# EAGLE design qtpychargerpzt3904 (EAGLE 9.6.2)
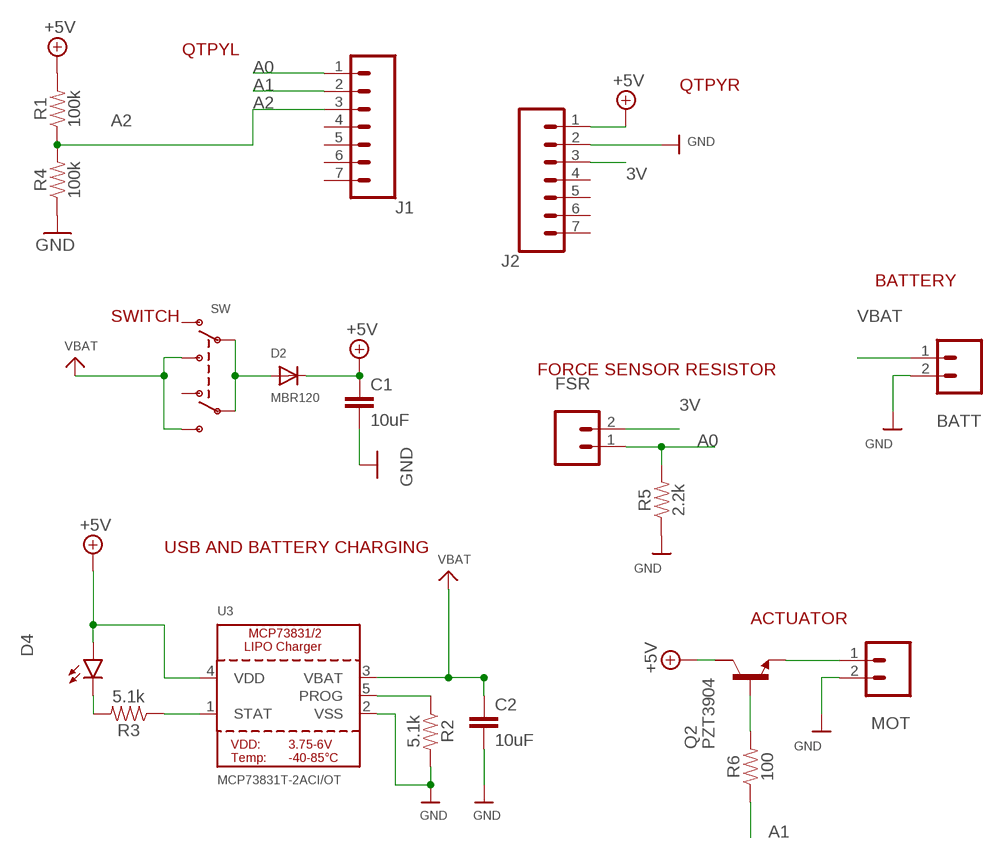
[diagram p0: schematic, sheet 1]

## Parts
BATT  CONN_02  [1X02]
C1  10uF  10UF-1206-6.3V-20%  [1206]
C2  10uF  10UF-1206-6.3V-20%  [1206]
D2  MBR120  DIODE_SOD-123FL  [SOD-123FL]
D4  LED1206  [LED-1206]
FSR  CONN_02  [1X02]
J1  CONN_07  [1X07]
J2  CONN_07  [1X07]
MOT  CONN_02  [1X02]
Q2  PZT3904  [SOT223]
R1  100k  RESISTOR1206  [1206]
R2  5.1k  RESISTOR1206  [1206]
R3  5.1k  RESISTOR1206  [1206]
R4  100k  RESISTOR1206  [1206]
R5  2.2k  RESISTOR1206  [1206]
R6  100  RESISTOR1206  [1206]
SW  SWITCH_DPDTEG1390  [EG1390]
U3  MCP73831T-2ACI/OT  MCP73831/2  [SOT23-5]

## Nets
3V [power]: FSR.2 J2.3
+5V [power]: C1.1 D2.C D4.A J2.1 Q2.2(C) R1.2 U3.4(VDD)
A0: FSR.1 J1.1 R5.2
A1: J1.2 R6.1
A2: J1.3 R1.1 R4.2
GND [power]: BATT.2 C1.2 C2.2 J2.2 MOT.2 R2.2 R4.1 R5.1 U3.2(VSS)
N$1: Q2.1(B) R6.2
N$2: D4.C R3.2
N$3: R3.1 U3.1(STAT)
N$4: R2.1 U3.5(PROG)
N$5: MOT.1 Q2.3(E)
N$7 [power]: D2.A SW.P1 SW.P2
VBAT [power]: BATT.1 C2.1 SW.S1 SW.S2 U3.3(VBAT)
Unconnected: J1.4 J1.5 J1.6 J1.7 J2.4 J2.5 J2.6 J2.7 Q2.4(C) SW.O1 SW.O2

## Notes on the sheet
- QTPYL
- QTPYR
- BATTERY
- SWITCH
- FORCE SENSOR RESISTOR
- USB AND BATTERY CHARGING
- ACTUATOR

## Library data of the parts
BATT FSR MOT = SparkFun-Connectors:CONN_02: Multi connection point. Often used as Generic Header-pin footprint for 0.1 inch spaced/style header connections On any of the 0.1 inch spaced packages, you can populate with these: Break Away Headers - Straight <https://www.sparkfun.com/products/116> (PRT-00116) Break Away Male Headers - Right Angle <https://www.sparkfun.com/products/553> (PRT-00553) Female Headers <https://www.sparkfun.com/products/115> (PRT-00115) Break Away Headers - Machine Pin <https://www.sparkfun.com/products/117> (PRT-00117) Break Away Female Headers - Swiss Machine Pin <https://www.sparkfun.com/products/743> (PRT-00743) For SCREWTERMINALS and SPRING TERMINALS visit here: Screw Terimnals on SparkFun.com <https://www.sparkfun.com/search/results?term=Screw+Terminals> (5mm/3.5mm/2.54mm spacing) This device is also useful as a general connection point to wire up your design to another part of your project. Our various solder wires solder well into these plated through hole pads. Hook-Up Wire - Assortment (Stranded, 22 AWG) <https://www.sparkfun.com/products/11375> (PRT-11375) Hook-Up Wire - Assortment (Solid Core, 22 AWG) <https://www.sparkfun.com/products/11367> (PRT-11367) View the entire wire category on our website here <https://www.sparkfun.com/categories/141> Special notes: Molex polarized connector foot print use with: PRT-08233 with associated crimp pins and housings. 2.54_SCREWTERM for use with PRT-10571. 3.5mm Screw Terminal footprints for PRT-08084 5mm Screw Terminal footprints for use with PRT-08432
C1 C2 = SparkFun-Capacitors:10UF: 10.0µF ceramic capacitors A capacitor is a passive two-terminal electrical component used to store electrical energy temporarily in an electric field.; PROD_ID: CAP-10057
D2 = adafruit:DIODE: Diode SMADIODE - SMA Surface Mount Package 20V 1A Schottky Diode Digikey: 641-1014-6-ND DO-1N4148 - Through Hole Small Current Diode SOD-123 20V 1 A (.5mV Vf) Schottky Diode - Digikey: MBRX120TPMSCT-ND SOD-323 10V 570mA (.38mV Vf, 3ns) Schottky Diode - Digikey: ZLLS410CT-ND SOD-523 30V 30mA Schottky Diode (RB751S-40TE61) - Digikey: RB751S-40TE61CT-ND SOT23-R/W - SOT23 Package (R = Solder Paste/Reflow Ovens, W = Hand-Soldering) BAT54Film 40V 300mA - Digikey: 497-7162-1-ND
D4 = SparkFun-LED:LED: LED (Generic) Standard schematic elements and footprints for 5mm, 3mm, 1206, and 0603 sized LEDs. Generic LEDs with no color specified.
J1 J2 = SparkFun-Connectors:CONN_07: Multi connection point. Often used as Generic Header-pin footprint for 0.1 inch spaced/style header connections On any of the 0.1 inch spaced packages, you can populate with these: Break Away Headers - Straight <https://www.sparkfun.com/products/116> (PRT-00116) Break Away Male Headers - Right Angle <https://www.sparkfun.com/products/553> (PRT-00553) Female Headers <https://www.sparkfun.com/products/115> (PRT-00115) Break Away Headers - Machine Pin <https://www.sparkfun.com/products/117> (PRT-00117) Break Away Female Headers - Swiss Machine Pin <https://www.sparkfun.com/products/743> (PRT-00743) For SCREWTERMINALS and SPRING TERMINALS visit here: Screw Terimnals on SparkFun.com <https://www.sparkfun.com/search/results?term=Screw+Terminals> (5mm/3.5mm/2.54mm spacing) This device is also useful as a general connection point to wire up your design to another part of your project. Our various solder wires solder well into these plated through hole pads. Hook-Up Wire - Assortment (Stranded, 22 AWG) <https://www.sparkfun.com/products/11375> (PRT-11375) Hook-Up Wire - Assortment (Solid Core, 22 AWG) <https://www.sparkfun.com/products/11367> (PRT-11367) View the entire wire category on our website here <https://www.sparkfun.com/categories/141> Special notes: Molex polarized connector foot print use with SKU : PRT-08231 with associated crimp pins and housings. 1MM SMD Version SKU: PRT-10208 NOTES ON THE VARIANTS LOCK and LOCK_LONGPADS... This footprint was designed to help hold the alignment of a through-hole component (i.e. 6-pin header) while soldering it into place. You may notice that each hole has been shifted either up or down by 0.005 of an inch from it's more standard position (which is a perfectly straight line). This slight alteration caused the pins (the squares in the middle) to touch the edges of the holes. Because they are alternating, it causes a "brace" to hold the component in place. 0.005 has proven to be the perfect amount of "off-center" position when using our standard breakaway headers. Although looks a little odd when you look at the bare footprint, once you have a header in there, the alteration is very hard to notice. Also,if you push a header all the way into place, it is covered up entirely on the bottom side.
Q2 = PZT3904:PZT3904: NPN Transistor Check availability <https://pricing.snapeda.com/parts/PZT3904/ON%20Semiconductor/view-part?ref=eda>; AVAILABILITY: In Stock; CHECK_PRICES: https://www.snapeda.com/parts/PZT3904/Onsemi/view-part/?ref=eda; DESCRIPTION: Bipolar (BJT) Transistor NPN 40 V 200 mA 300MHz 1.5 W Surface Mount SOT-223 (TO-261); MF: ON Semiconductor; MP: PZT3904; PACKAGE: SOT-223-4 ON Semiconductor; PRICE: None; SNAPEDA_LINK: https://www.snapeda.com/parts/PZT3904/Onsemi/view-part/?ref=snap
R1-R6 = SparkFun-Resistors:RESISTOR: Generic Resistor Package
SW = adafruit_electromech:SWITCH_DPDT: Switch - DPDT A DPDT Switch acts like an SPDT switch, but has a pair of switches instead of just one. Vertical - 0.3A @ 6V SMT - Digikey: JS202011SCQN
U3 = microbuilder:MCP73831/2: MCP73831/2 LIPO Charger VDD: 3.75 - 6V Temp -40 - 85°C Programmable Charge Rate: 15-500mA NOTE: STAT is a tri-state logic output on the MCP73831 and an open-drain output on the MCP73832. SOT23-5 with 4.2V output and tri-state logic on STAT = MCP73831T-2ACI/OT

## Net classes
1 power: width 0.305 mm

## Board
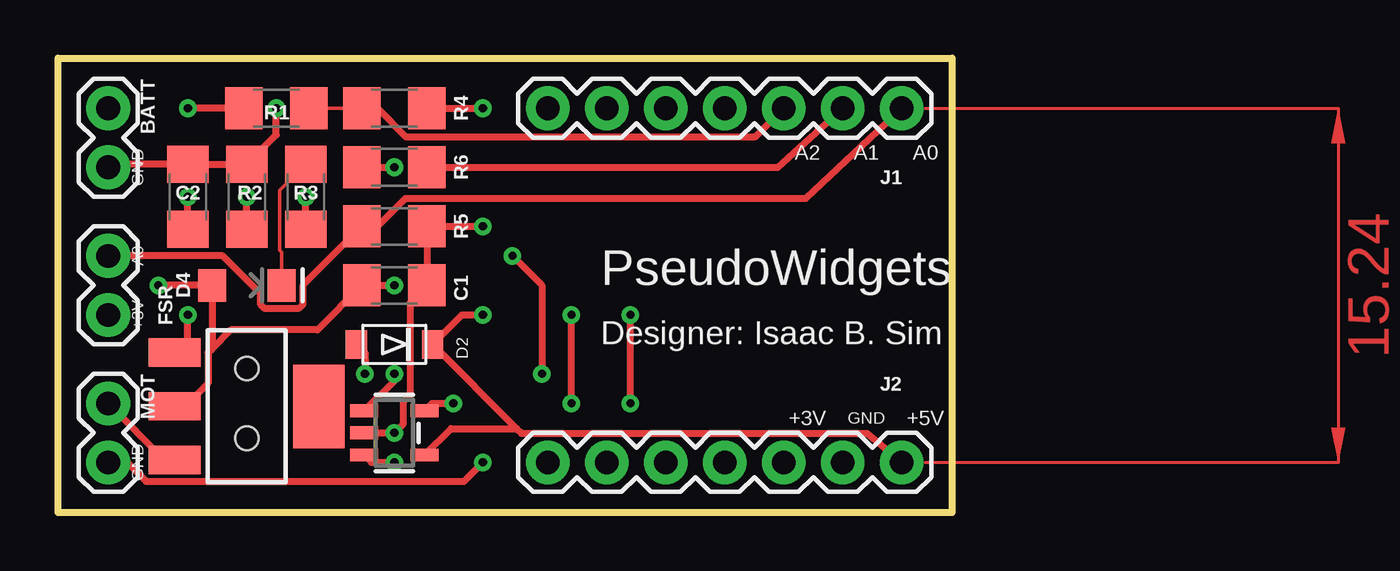
[diagram p1: board, top side]
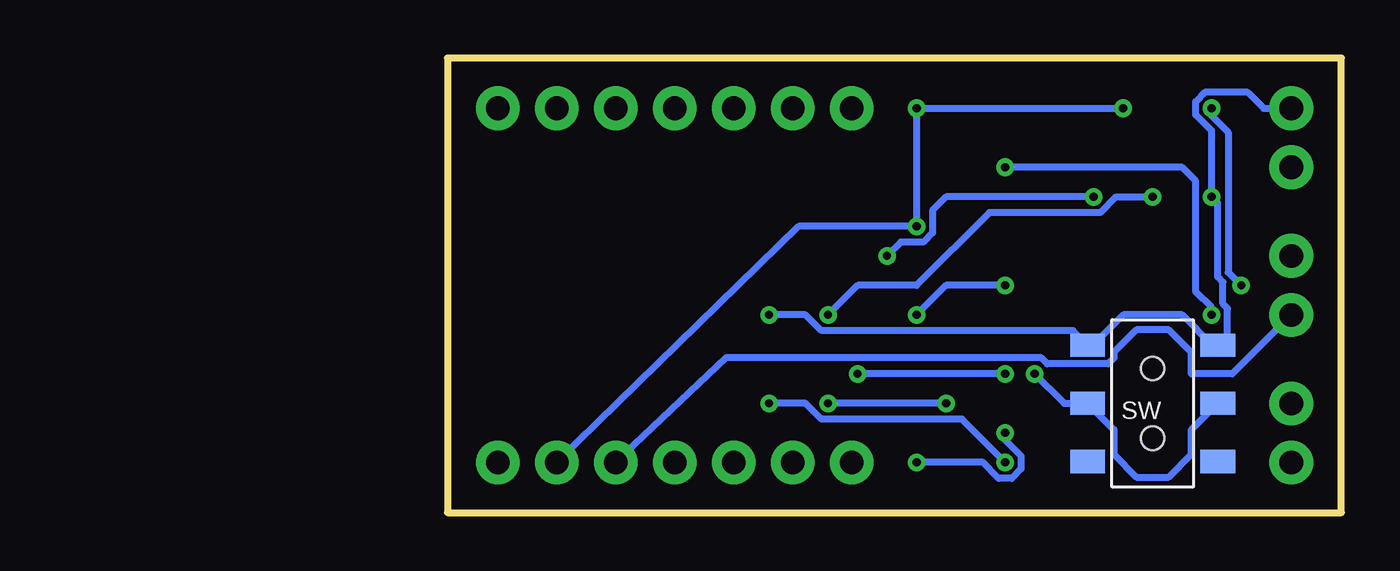
[diagram p2: board, bottom side, seen from below]

Size 38.48 x 19.56 mm. Coordinates in mm from the lower left corner, seen from the top.
Outline: 38.48,19.56 38.48,0 0,0 0,19.56 38.48,19.56
Copper layers (1*16): Top 0.035mm / dielectric 1.5mm / Bottom 0.035mm
Design rules "default": minimum track width 6mil, minimum drill 0.35mm, track to track 6mil, track to pad 6mil, pad to pad 6mil, via to via 6mil, smd to smd 6mil, copper to edge 40mil, drill to drill 6mil, minimum pad ring 10mil, minimum via ring 8mil, stop-mask expansion 4mil, vias tented up to drill 0mil, thermal gap 10mil

### Footprints (pad centres in the part's own frame; a part is rotated, then mirrored left to right if it is on the bottom)
1X02 = drill 1.016 pad 1.88: 1 0,0; 2 2.54,0
1206 = smd 1.6 x 1.8: 1 -1.4,0; 2 1.4,0
SOD-123FL = smd 0.91 x 1.22: A 1.637,0; C -1.637,0
LED-1206 = smd 1.2 x 1.4: A -1.5,0; C 1.5,0
1X07 = drill 1.016 pad 1.88: 1 0,0; 2 2.54,0; 3 5.08,0; 4 7.62,0; 5 10.16,0; 6 12.7,0; 7 15.24,0
SOT223 = smd 1.219 x 2.235: 1 -2.311,-3.099; 2 0,-3.099; 3 2.311,-3.099 | smd 3.6 x 2.2: 4 0,3.099
EG1390 = smd 1 x 1.5: O1 -2.5,2.8; O2 -2.5,-2.8; P1 0,2.8; P2 0,-2.8; S1 2.5,2.8; S2 2.5,-2.8 | hole 1: 1.5,0; -1.5,0
SOT23-5 = smd 0.55 x 1.2: 1 -0.95,-1.3; 2 0,-1.3; 3 0.95,-1.3; 4 0.95,1.3; 5 -0.95,1.3

### Placement (x,y rotation side)
BATT  2.16,17.4 270 top
C1  14.48,9.78 0 top
C2  5.59,13.59 90 top
D2  14.48,7.24 180 top
D4  8.13,9.78 0 top
FSR  2.16,11.05 270 top
J1  36.32,17.4 180 top
J2  36.32,2.16 180 top
MOT  2.16,4.7 270 top
Q2  8.13,4.57 270 top
R1  9.4,17.4 180 top
R2  8.13,13.59 90 top
R3  10.67,13.59 90 top
R4  14.48,17.4 180 top
R5  14.48,12.32 180 top
R6  14.48,14.86 180 top
SW  8.13,4.7 90 bottom
U3  14.48,3.43 270 top

### Tracks (layer width: path | path; a pad name or v marks a point on that pad's centre or on a via)
3V
  Bottom 0.305: FSR.2 4.7,5.97 6.46,5.97 6.46,6.89 7.44,7.87 8.82,7.87 9.8,6.89 9.8,6.65 10.05,6.39 12.67,6.39 12.92,6.65 26.5,6.65 J2.3
+5V  (via drill 0.35)
  Top 0.305: J2.1 34.82,3.4 19.95,3.4 19.74,3.61 | 19.74,3.61 D2.C 17.39,8.51 v18.29,8.51 | 6.63,7.06 D4.A v4.32,9.78 | 6.63,7.06 6.46,6.89 6.46,5.57 5.46,4.57 Q2.2 | 6.63,7.06 7.44,7.87 11.17,7.87 C1.1 v14.48,9.78 | U3.4 16.91,3.61 19.74,3.61 | R1.2 v5.59,17.4
  Bottom 0.305: v5.59,17.4 5.59,17.08 4.87,16.36 4.87,10.33 v4.32,9.78 | v14.48,9.78 17.02,9.78 v18.29,8.51
A0
  Top 0.305: J1.1 32.19,13.52 14.95,13.52 13.75,12.32 R5.2 10.53,9.77 10.53,8.95 10.35,8.77 8.9,8.77 8.72,8.95 8.72,9.42 7.09,11.05 FSR.1
A1
  Top 0.305: R6.1 30.99,14.86 J1.2
A2
  Top 0.152: R4.2 R1.1
  Top 0.305: R4.2 13.75,17.4 14.99,16.15 30,16.15 J1.3
GND  (via drill 0.35)
  Top 0.305: R4.1 v18.29,17.4 | v18.29,12.32 R5.1 C1.2 15.18,9.08 15.18,5.09 14.87,4.78 14.87,3.82 v14.48,3.43 U3.2 | MOT.2 2.97,2.16 3.78,1.35 17.47,1.35 v18.29,2.16 | v9.4,17.4 9.4,16.26 R2.2 C2.2 2.29,14.99 BATT.2
  Bottom 0.305: J2.2 23.37,12.32 v18.29,12.32 v18.29,17.4 v9.4,17.4 | v14.48,3.43 14.48,3.13 13.79,2.44 13.79,1.88 14.2,1.48 14.76,1.48 15.44,2.16 v18.29,2.16
N$1  (via drill 0.35)
  Top 0.305: Q2.1 5.59,7.44 v5.59,8.51 | R6.2 v14.48,14.86
  Bottom 0.305: v5.59,8.51 5.59,8.83 6.27,9.51 6.27,14.27 6.86,14.86 v14.48,14.86
N$2
  Top 0.152: D4.C 9.63,11.21 9.54,11.29 9.54,13.86 R3.2
N$3  (via drill 0.35)
  Top 0.305: U3.1 14.48,5.68 v14.48,5.97 | R3.1 v10.67,13.59 | v19.56,11.05 20.83,9.78 v20.83,5.97
  Bottom 0.305: v14.48,5.97 v20.83,5.97 | v10.67,13.59 17.02,13.59 17.61,13 17.61,12.04 18,11.64 18.97,11.64 v19.56,11.05
N$4  (via drill 0.35)
  Top 0.305: U3.5 16.1,4.7 v17.02,4.7 | v22.1,4.7 v22.1,8.51 | R2.1 v8.13,13.59
  Bottom 0.305: v17.02,4.7 v22.1,4.7 | v22.1,8.51 20.83,9.78 18.29,9.78 15.16,12.91 10.38,12.91 9.7,13.59 v8.13,13.59
N$5
  Top 0.305: MOT.1 4.6,2.26 Q2.3
N$7  (via drill 0.35)
  Top 0.305: D2.A 13.21,6.87 v13.21,5.97
  Bottom 0.305: v13.21,5.97 11.94,4.7 SW.P1 9.8,3.57 9.8,2.51 8.82,1.53 7.44,1.53 6.46,2.51 6.46,3.57 SW.P2
VBAT  (via drill 0.35)
  Top 0.305: C2.1 v5.59,13.59 | U3.3 13.5,2.16 v14.48,2.16 | v24.64,4.7 v24.64,8.51
  Bottom 0.305: BATT.1 3.35,17.4 4.04,18.08 5.87,18.08 6.27,17.68 6.27,17.12 5.59,16.43 v5.59,13.59 5.33,13.33 5.33,10.14 5.11,9.92 5.11,8.99 4.9,8.79 4.9,7.62 SW.S2 5.55,7.2 6.86,8.51 9.4,8.51 10.67,7.24 10.67,7.2 SW.S1 11.55,7.83 22.38,7.83 23.06,8.51 v24.64,8.51 | v14.48,2.16 16.34,4.02 22.38,4.02 23.06,4.7 v24.64,4.7
(copper drawn outside any net)
  shapes: Top area x1

### Text on the board
tPlace: GND | A2 | A1 | A0 | A0 | PseudoWidgets | +3V | Designer: Isaac B. Sim | +3V | GND | +5V | GND